# Altium schematic sheet Current_Sens.SchDoc
size A4; SheetNumber: 5; SheetTotal: 5
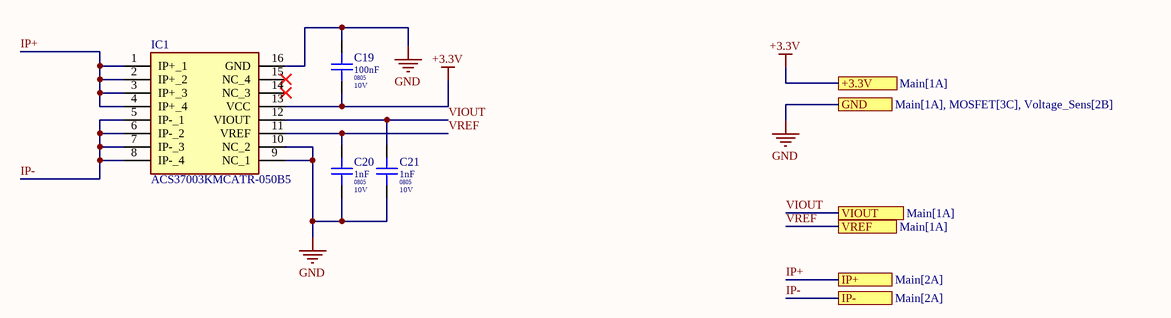
[diagram p0: Current_Sens.SchDoc]

## Parts
C19  Package / Case: 0805  Voltage: 10V  [CAPC 0805]  (hidden comment: 100nF)
C20  Package / Case: 0805  Voltage: 10V  [CAPC 0805]  (hidden comment: 1nF)
C21  Package / Case: 0805  Voltage: 10V  [CAPC 0805]  (hidden comment: 1nF)
IC1  ACS37003KMCATR-050B5  [ACS37002LMCA050U5]

## Ports
+3.3V (see Main[1A]), GND (see Main[1A], MOSFET[3C], Voltage_Sens[2B]), IP+ (see Main[2A]), IP- (see Main[2A]), VIOUT (see Main[1A]), VREF (see Main[1A])

## Nets
+3.3V: C19.1 IC1.13(VCC) ; port +3.3V
GND: C19.2 C20.1 C21.1 IC1.9(NC_1) IC1.10(NC_2) IC1.16(GND) ; port GND
IP+: IC1.1(IP+_1) IC1.2(IP+_2) IC1.3(IP+_3) IC1.4(IP+_4) ; port IP+
IP-: IC1.5(IP-_1) IC1.6(IP-_2) IC1.7(IP-_3) IC1.8(IP-_4) ; port IP-
VIOUT: C21.2 IC1.12(VIOUT) ; port VIOUT
VREF: C20.2 IC1.11(VREF) ; port VREF

Not connected (* = marked no-connect by the designer): IC1 14(NC_3)* 15(NC_4)*

## Library data of the parts
C19 = CAPC0744: Capacitor Ceramic 100nF 10V 0805; Tolerance: %10; Value Rating: nF; Value: 100nF; Part Number: CAPC0744; Category: Capacitor Ceramic; Values: 100nF 10V
C20 C21 = CAPC0728: Capacitor Ceramic 1nF 10V 0805; Tolerance: %10; Value Rating: nF; Values: 1nF 10V; Value: 1nF; Part Number: CAPC0728; Category: Capacitor Ceramic
IC1 = ACS37003KMCATR-050B5: Integrated Circuit; Manufacturer_Name: Allegro Microsystems; Datasheet Link: https://www.allegromicro.com/~/media/files/datasheets/acs37003mc-datasheet.pdf; Height: 3.285mm; Manufacturer_Part_Number: ACS37003KMCATR-050B5; Mouser Part Number: 250-03KMCATR-050B5; Mouser Price/Stock: https://www.mouser.co.uk/ProductDetail/Allegro-MicroSystems/ACS37003KMCATR-050B5?qs=e8oIoAS2J1SA8AOU7XDYIg%3D%3D; Arrow Part Number: ACS37003KMCATR-050B5; Arrow Price/Stock: https://www.arrow.com/en/products/acs37003kmcatr-050b5/allegro-microsystems?utm_currency=USD&region=nac